# Altium schematic sheet 11-multimodal-combined-sensor.SchDoc
size A4; SheetNumber: 8; SheetTotal: 11
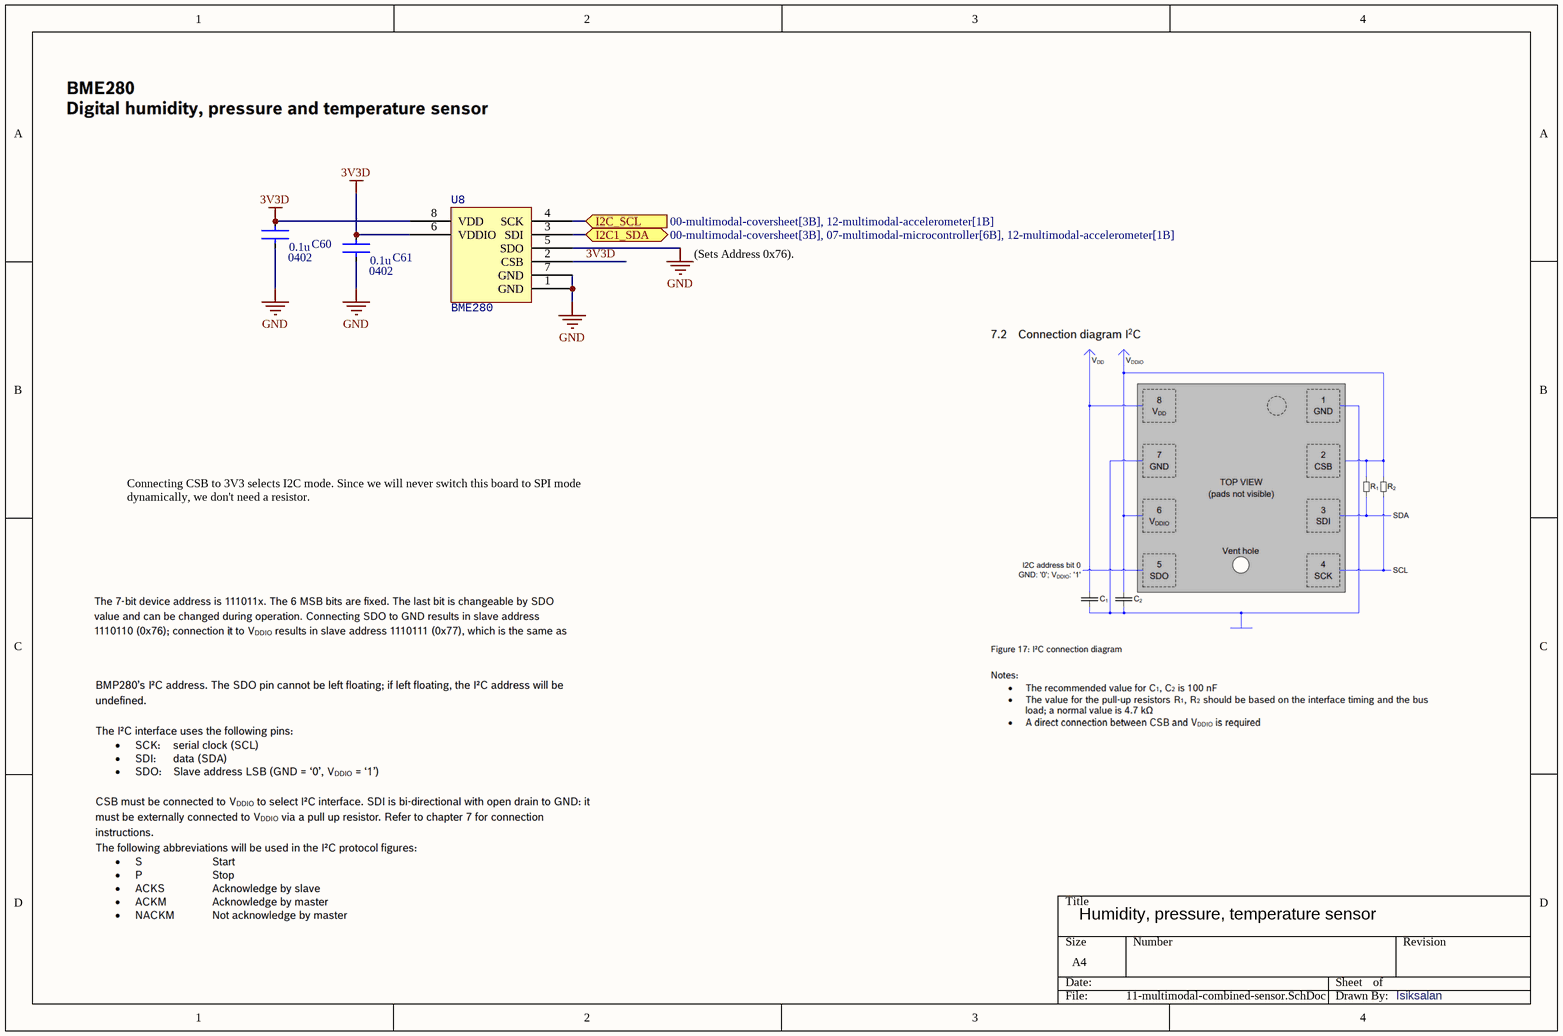
[diagram p0: 11-multimodal-combined-sensor.SchDoc]

## Parts
C60  C1005X7R1H104K050BB  [CAPTDK0402]  (value not drawn)
C61  C1005X7R1H104K050BB  [CAPTDK0402]  (value not drawn)
U8  BME280  [BME280_FOOTPRINT]

## Ports
I2C1_SDA (bidir, see 00-multimodal-coversheet[3B], 07-multimodal-microcontroller[6B], 12-multimodal-accelerometer[1B]), I2C_SCL (in, see 00-multimodal-coversheet[3B], 12-multimodal-accelerometer[1B])

## Nets
3V3D: C60.1 C61.1 U8.2(CSB) U8.6(VDDIO) U8.8(VDD)
GND: C60.2 C61.2 U8.1(GND) U8.5(SDO) U8.7(GND)
I2C1_SDA: U8.3(SDI) ; port I2C1_SDA
I2C_SCL: U8.4(SCK) ; port I2C_SCL

## Notes on the sheet
- (Sets Address 0x76).
- Connecting CSB to 3V3 selects I2C mode. Since we will never switch this board to SPI mode dynamically, we don't need a resistor.
- Humidity, pressure, temperature sensor
- Isiksalan
- (in symbol C1005X7R1H104K050BB) 0.1u; 0402

## Library data of the parts
C60 C61 = C1005X7R1H104K050BB: CAP CER 0.1UF 50V X7R 0402; Supplier 1: Digi-Key; Supplier Part Number 1: 445-5932-1-ND
U8 = BME280: SENSOR PRESSURE HUMIDITY TEMP Humidity, Pressure, Temperature 0 ~ 100% RH I2C, SPI ±3% 1 s Surface Mount